# EasyEDA schematic EasyEDA File.json
TITLE: Electronic Target Turn; REV: 1.4; Date: 2021-08-17; Sheet: 1/1; Drawn By: smdial; Company: Scott Dial
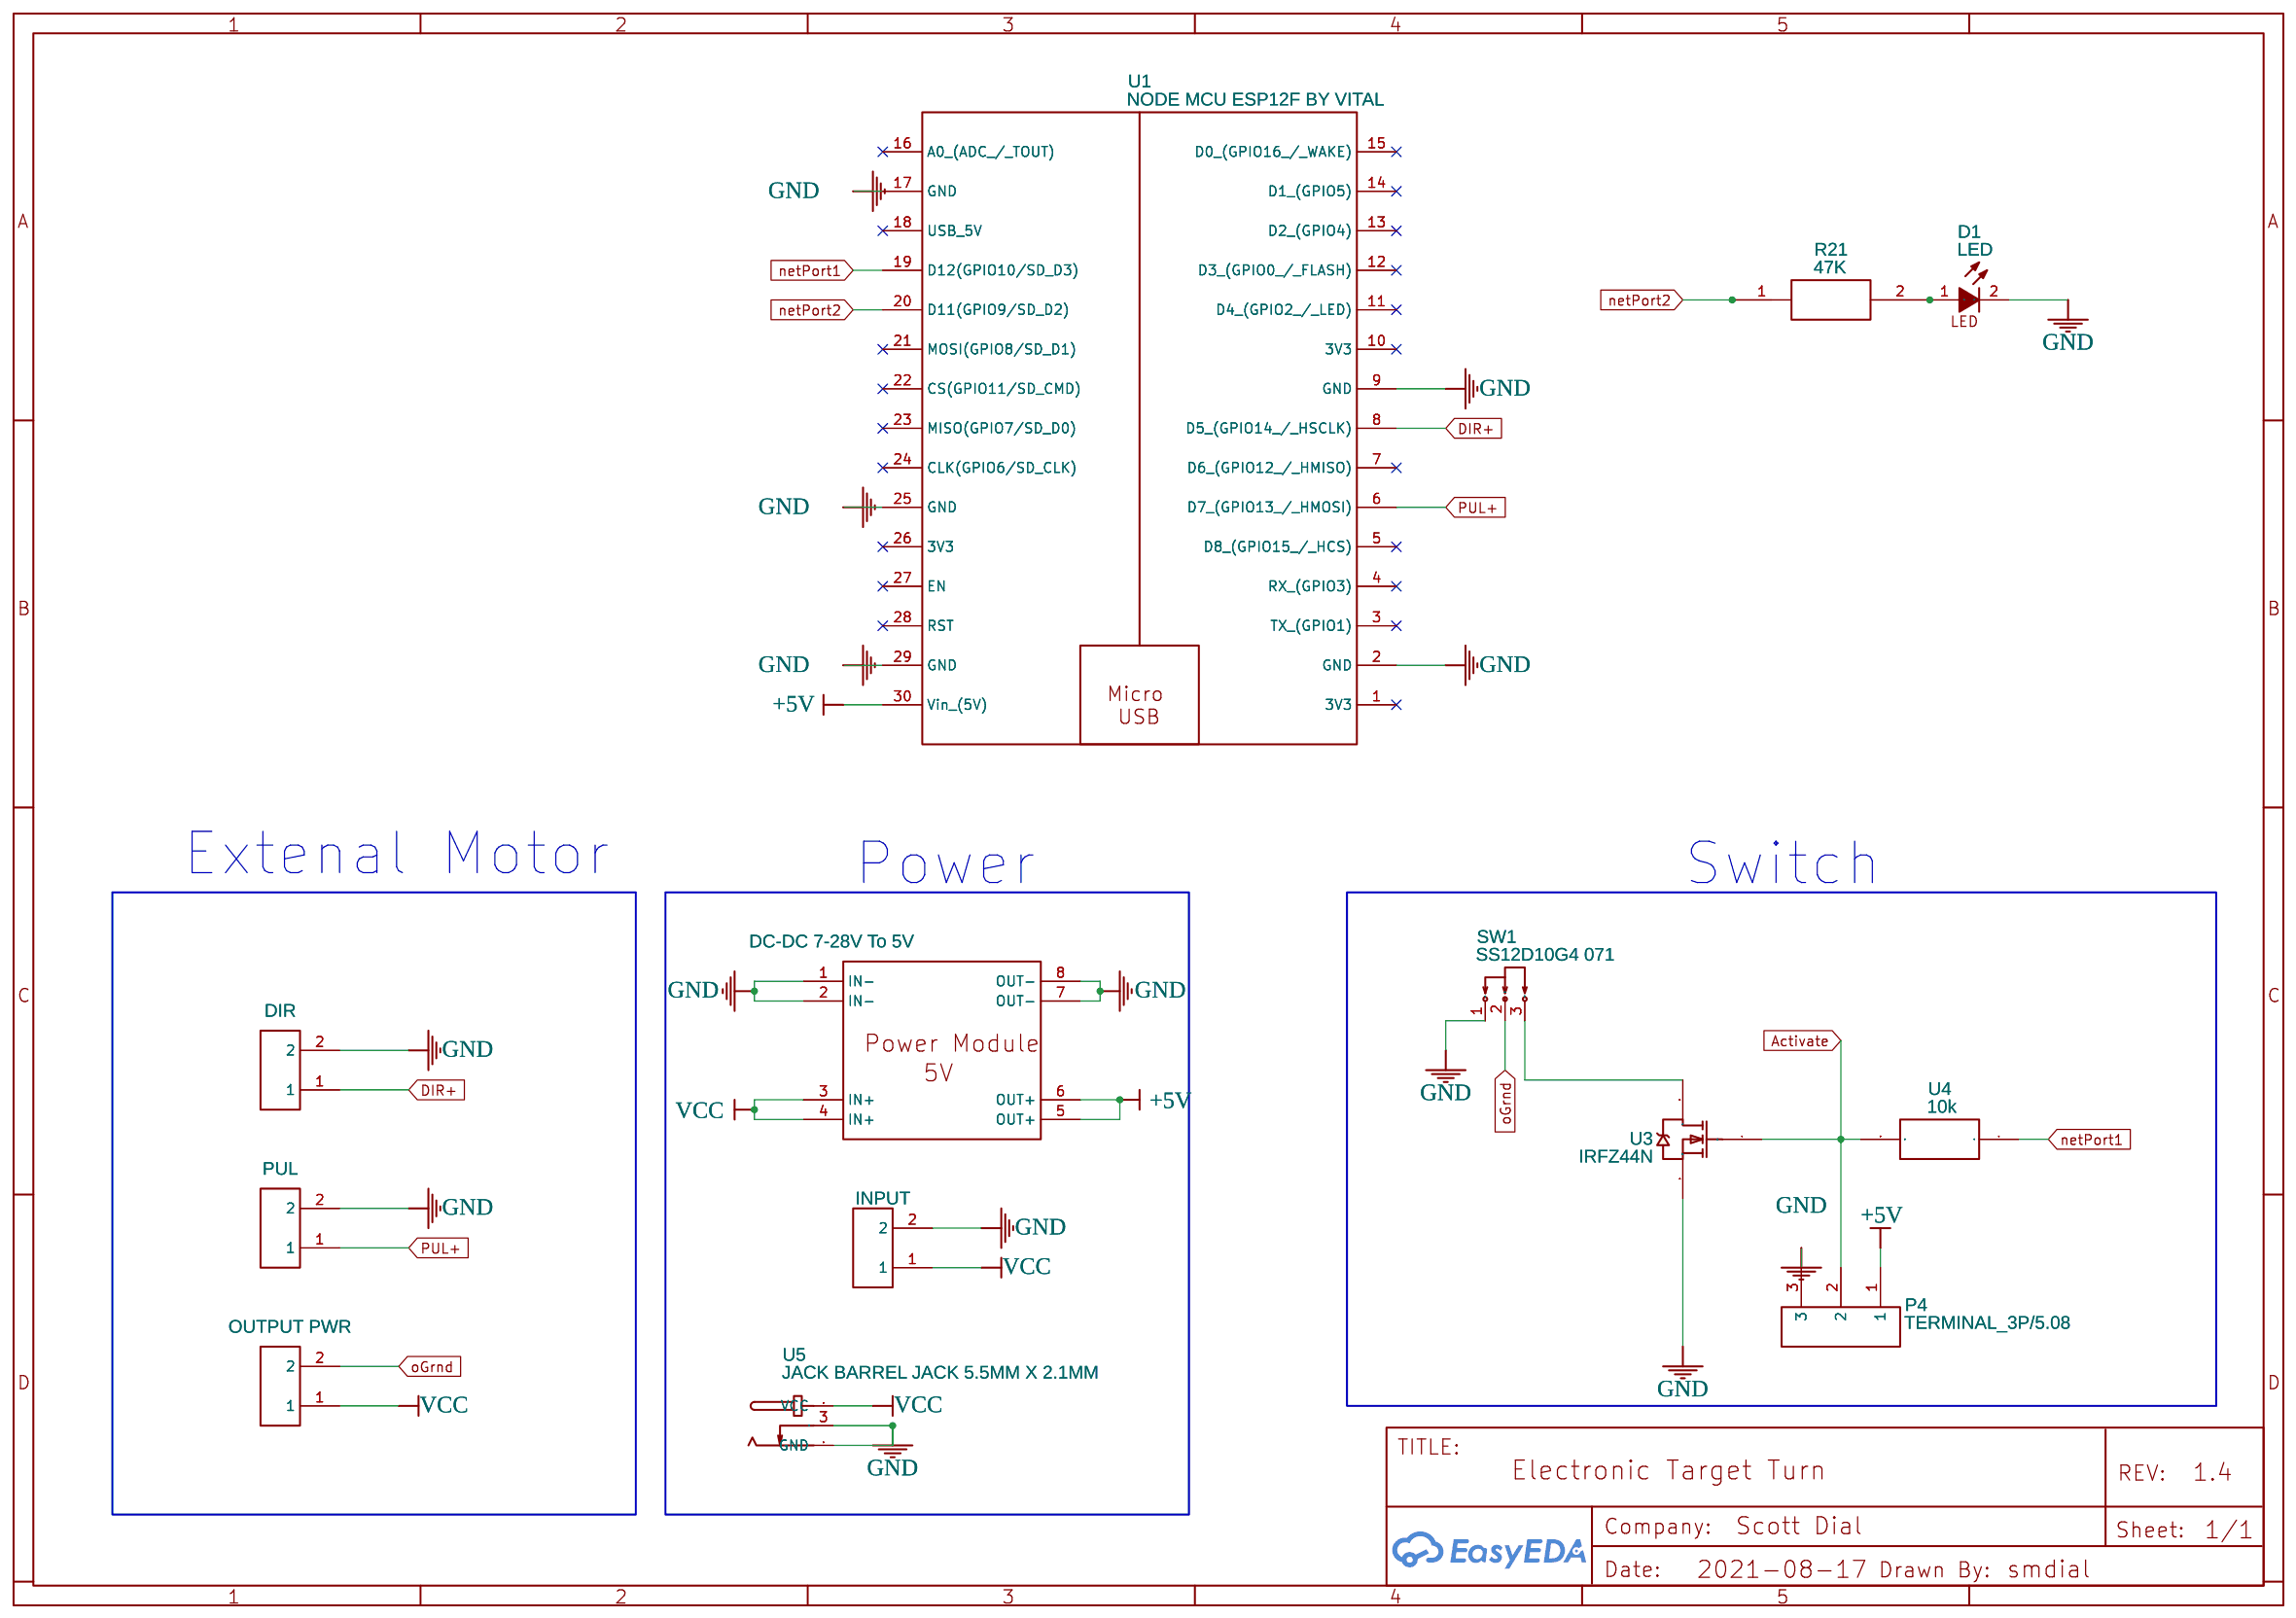
[diagram p0: schematic sheet]

## Parts
D1  LED  [LED-TH_LED-DP2-2LED-AMCC]
P1  DIR  [5.08-2P_SCREW_TERMINAL]
P2  PUL  [5.08-2P_SCREW_TERMINAL]
P3  INPUT  [5.08-2P_SCREW_TERMINAL]
P4  TERMINAL_3P/5.08  [5.08-3P_SCREW_TERMINAL]
P5  OUTPUT PWR  [5.08-2P_SCREW_TERMINAL]
R21  47K  [47K]
SW1  SS12D10G4 071  [SW-TH_SHOU-HAN_SS12D10G4]
U1  NODE MCU ESP12F BY VITAL  [NODE MCU V3 BY VITAL]
U2  DC-DC 7-28V To 5V  [DM02]
U3  IRFZ44N  [IRFZ44N]
U4  10k  [RESISTOR]
U5  JACK BARREL JACK 5.5MM X 2.1MM  [BARREL JACK DC]

## Library data of the parts
D1 = LED: Supplier: Digi-Key; Manufacturer: VccLite; Manufacturer Part: 5600; Supplier Part: L20325-ND; link: https://vcclite.com/product/5602f5-5v/; Contributor: tomevukic
P1-P3 P5 = SCREW TERMINAL 2P: Manufacturer Part: Screw terminal 2p; Contributor: georges_circuits
P4 = TERMINAL_3P/5.08: Manufacturer Part: Screw terminal 3p; Contributor: reino.forward
R21 = 47K: Contributor: dodecahedron
SW1 = SS12D10G4 071: Supplier: LCSC; Supplier Part: C2887259; Manufacturer: SHOU HAN(首韩); Contributor: LCSC; JLCPCB Part Class: Extended Part
U1 = NODE MCU ESP12F BY VITAL: Contributor: vitalgolov_2141
U2 = DC-DC 7-28V To 5V Step Down Power Supply Module: link: DM02 POWER MODULE; Contributor: wichienkob
U3 = IRFZ44N: Manufacturer: International Rectifier; link: https://www.vishay.com/docs/91291/91291.pdf; Contributor: mehmetbey
U4 = RESISTOR: Contributor: 12348
U5 = JACK BARREL JACK 5.5MM X 2.1MM: Contributor: Sean Simpson

## Nets
+5V: P4.1 U1.30(Vin (5V)) U2.5(OUT+) U2.6(OUT+)
GND: D1.2(K) P1.2 P2.2 P3.2 P4.3 SW1.1 U1.2(GND) U1.9(GND) U1.17(GND) U1.25(GND) U1.29(GND) U2.1(IN-) U2.2(IN-) U2.7(OUT-) U2.8(OUT-) U3.3(S) U5.2(GND) U5.3
VCC: P3.1 P5.1 U2.3(IN+) U2.4(IN+) U5.1(VCC)
Activate: P4.2 U3.1(G) U4.2
DIR+: P1.1 U1.8(D5 (GPIO14 / HSCLK))
netPort1: U1.19(D12(GPIO10/SD_D3)) U4.1
netPort2: R21.1 U1.20(D11(GPIO9/SD_D2))
oGrnd: P5.2 SW1.2
PUL+: P2.1 U1.6(D7 (GPIO13 / HMOSI))
Net-(D1-1): D1.1(A) R21.2
Net-(SW1-3): SW1.3 U3.2(D)

Not connected (* = marked no-connect by the designer): U1 1(3V3)* 3(TX (GPIO1))* 4(RX (GPIO3))* 5(D8 (GPIO15 / HCS))* 7(D6 (GPIO12 / HMISO))* 10(3V3)* 11(D4 (GPIO2 / LED))* 12(D3 (GPIO0 / FLASH))* 13(D2 (GPIO4))* 14(D1 (GPIO5))* 15(D0 (GPIO16 / WAKE))* 16(A0 (ADC / TOUT))* 18(USB 5V)* 21(MOSI(GPIO8/SD_D1))* 22(CS(GPIO11/SD_CMD))* 23(MISO(GPIO7/SD_D0))* 24(CLK(GPIO6/SD_CLK))* 26(3V3)* 27(EN)* 28(RST)*

## Notes on the sheet
- Extenal Motor
- Power
- Switch
